# EAGLE design ADC Board(Two Board,Molex) (EAGLE 7.6.0)
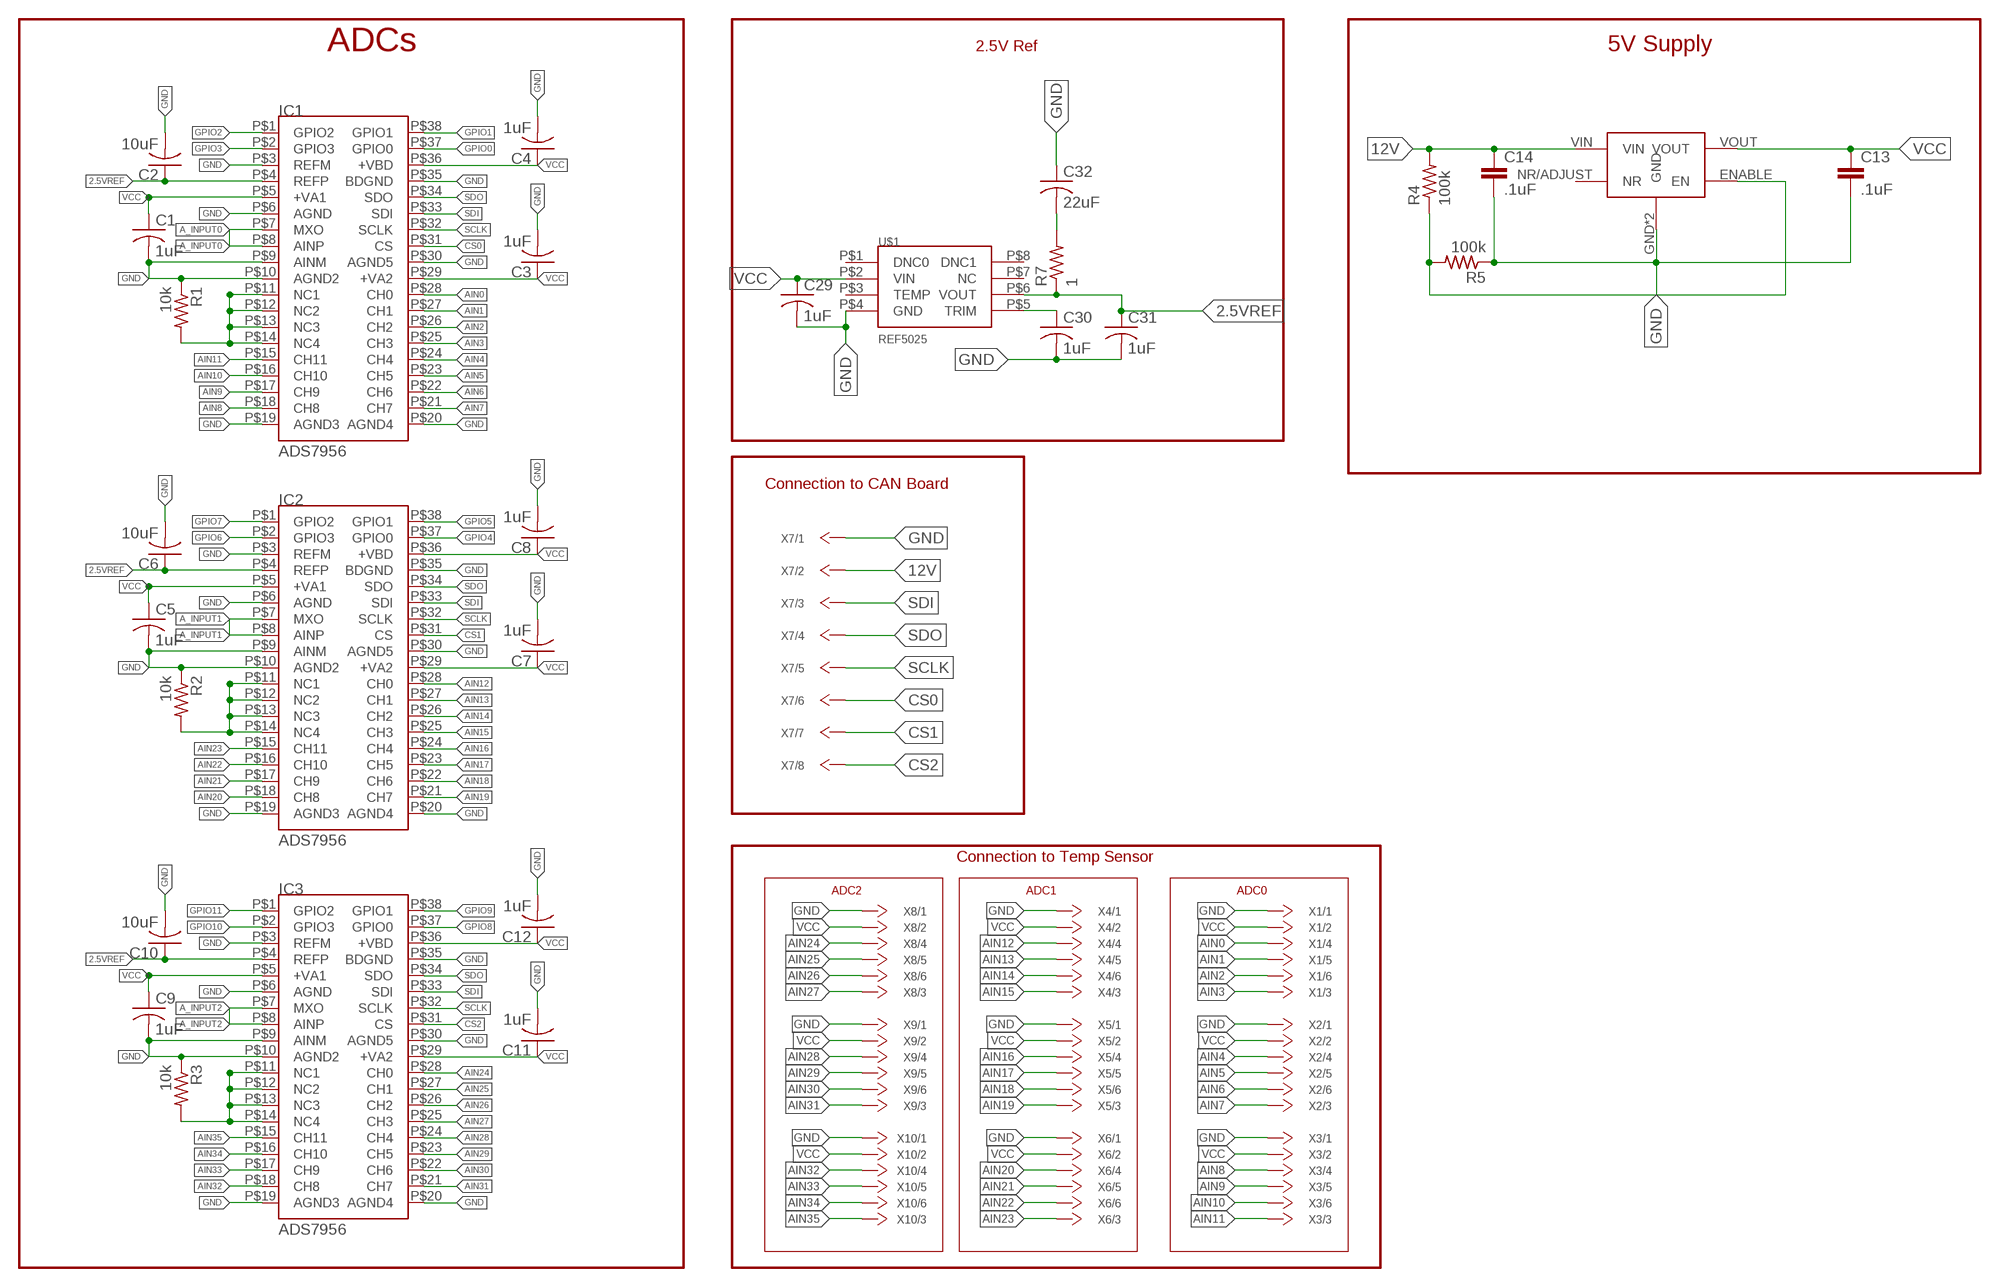
[diagram p0: schematic, sheet 1]

## Parts
C1  1uF  C-USC0603  [C0603]
C2  10uF  C-USC0603  [C0603]
C3  1uF  C-USC0603  [C0603]
C4  1uF  C-USC0603  [C0603]
C5  1uF  C-USC0603  [C0603]
C6  10uF  C-USC0603  [C0603]
C7  1uF  C-USC0603  [C0603]
C8  1uF  C-USC0603  [C0603]
C9  1uF  C-USC0603  [C0603]
C10  10uF  C-USC0603  [C0603]
C11  1uF  C-USC0603  [C0603]
C12  1uF  C-USC0603  [C0603]
C13  .1uF  C-EUC0603  [C0603]
C14  .1uF  C-EUC0603  [C0603]
C29  1uF  C-USC0603  [C0603]
C30  1uF  C-USC0603  [C0603]
C31  1uF  C-USC0603  [C0603]
C32  22uF  C-USC0603  [C0603]
IC1  ADS7956  [TSSOP-38]
IC2  ADS7956  [TSSOP-38]
IC3  ADS7956  [TSSOP-38]
R1  10k  R-US_R0603  [R0603]
R2  10k  R-US_R0603  [R0603]
R3  10k  R-US_R0603  [R0603]
R4  100k  R-US_M0805  [M0805]
R5  100k  R-US_M0805  [M0805]
R7  1  R-US_M0805  [M0805]
U$1  REF5025  [TSSOP-8(TI)]
U$2  REG-104GA-5  [REG104GA-5]
X1  6_PIN_CONNMOLEX_HORI  [6_PIN_MOLEX]
X2  6_PIN_CONNMOLEX_HORI  [6_PIN_MOLEX]
X3  6_PIN_CONNMOLEX_HORI  [6_PIN_MOLEX]
X4  6_PIN_CONNMOLEX_HORI  [6_PIN_MOLEX]
X5  6_PIN_CONNMOLEX_HORI  [6_PIN_MOLEX]
X6  6_PIN_CONNMOLEX_HORI  [6_PIN_MOLEX]
X7  8_PIN_CONN  [8_PIN_MOLEX]
X8  6_PIN_CONNMOLEX_HORI  [6_PIN_MOLEX]
X9  6_PIN_CONNMOLEX_HORI  [6_PIN_MOLEX]
X10  6_PIN_CONNMOLEX_HORI  [6_PIN_MOLEX]

## Nets
2.5VREF: C2.1 C6.1 C10.1 C31.1 IC1.P$4(REFP) IC2.P$4(REFP) IC3.P$4(REFP) R7.1 U$1.P$6(VOUT)
12V: C14.1 R4.2 U$2.VIN X7.P$2
A_INPUT0: IC1.P$7(MXO) IC1.P$8(AINP)
A_INPUT1: IC2.P$7(MXO) IC2.P$8(AINP)
A_INPUT2: IC3.P$7(MXO) IC3.P$8(AINP)
AIN0: IC1.P$28(CH0) X1.P$4
AIN1: IC1.P$27(CH1) X1.P$5
AIN2: IC1.P$26(CH2) X1.P$6
AIN3: IC1.P$25(CH3) X1.P$3
AIN4: IC1.P$24(CH4) X2.P$4
AIN5: IC1.P$23(CH5) X2.P$5
AIN6: IC1.P$22(CH6) X2.P$6
AIN7: IC1.P$21(CH7) X2.P$3
AIN8: IC1.P$18(CH8) X3.P$4
AIN9: IC1.P$17(CH9) X3.P$5
AIN10: IC1.P$16(CH10) X3.P$6
AIN11: IC1.P$15(CH11) X3.P$3
AIN12: IC2.P$28(CH0) X4.P$4
AIN13: IC2.P$27(CH1) X4.P$5
AIN14: IC2.P$26(CH2) X4.P$6
AIN15: IC2.P$25(CH3) X4.P$3
AIN16: IC2.P$24(CH4) X5.P$4
AIN17: IC2.P$23(CH5) X5.P$5
AIN18: IC2.P$22(CH6) X5.P$6
AIN19: IC2.P$21(CH7) X5.P$3
AIN20: IC2.P$18(CH8) X6.P$4
AIN21: IC2.P$17(CH9) X6.P$5
AIN22: IC2.P$16(CH10) X6.P$6
AIN23: IC2.P$15(CH11) X6.P$3
AIN24: IC3.P$28(CH0) X8.P$4
AIN25: IC3.P$27(CH1) X8.P$5
AIN26: IC3.P$26(CH2) X8.P$6
AIN27: IC3.P$25(CH3) X8.P$3
AIN28: IC3.P$24(CH4) X9.P$4
AIN29: IC3.P$23(CH5) X9.P$5
AIN30: IC3.P$22(CH6) X9.P$6
AIN31: IC3.P$21(CH7) X9.P$3
AIN32: IC3.P$18(CH8) X10.P$4
AIN33: IC3.P$17(CH9) X10.P$5
AIN34: IC3.P$16(CH10) X10.P$6
AIN35: IC3.P$15(CH11) X10.P$3
CS0: IC1.P$31(CS) X7.P$6
CS1: IC2.P$31(CS) X7.P$7
CS2: IC3.P$31(CS) X7.P$8
ENABLE: R4.1 R5.2 U$2.ENABLE(EN)
GND: C1.2 C2.2 C3.2 C4.2 C5.2 C6.2 C7.2 C8.2 C9.2 C10.2 C11.2 C12.2 C13.2 C14.2 C29.2 C30.2 C31.2 C32.1 IC1.P$3(REFM) IC1.P$6(AGND) IC1.P$9(AINM) IC1.P$10(AGND2) IC1.P$19(AGND3) IC1.P$20(AGND4) IC1.P$30(AGND5) IC1.P$35(BDGND) IC2.P$3(REFM) IC2.P$6(AGND) IC2.P$9(AINM) IC2.P$10(AGND2) IC2.P$19(AGND3) IC2.P$20(AGND4) IC2.P$30(AGND5) IC2.P$35(BDGND) IC3.P$3(REFM) IC3.P$6(AGND) IC3.P$9(AINM) IC3.P$10(AGND2) IC3.P$19(AGND3) IC3.P$20(AGND4) IC3.P$30(AGND5) IC3.P$35(BDGND) R1.1 R2.1 R3.1 R5.1 U$1.P$4(GND) U$2.GND U$2.HEATGND(GND) X1.P$1 X2.P$1 X3.P$1 X4.P$1 X5.P$1 X6.P$1 X7.P$1 X8.P$1 X9.P$1 X10.P$1
GPIO0: IC1.P$37(GPIO0)
GPIO1: IC1.P$38(GPIO1)
GPIO2: IC1.P$1(GPIO2)
GPIO3: IC1.P$2(GPIO3)
GPIO4: IC2.P$37(GPIO0)
GPIO5: IC2.P$38(GPIO1)
GPIO6: IC2.P$2(GPIO3)
GPIO7: IC2.P$1(GPIO2)
GPIO8: IC3.P$37(GPIO0)
GPIO9: IC3.P$38(GPIO1)
GPIO10: IC3.P$2(GPIO3)
GPIO11: IC3.P$1(GPIO2)
N$3: C32.2 R7.2
NC: IC1.P$11(NC1) IC1.P$12(NC2) IC1.P$13(NC3) IC1.P$14(NC4) R1.2
NC1: IC2.P$11(NC1) IC2.P$12(NC2) IC2.P$13(NC3) IC2.P$14(NC4) R2.2
NC2: IC3.P$11(NC1) IC3.P$12(NC2) IC3.P$13(NC3) IC3.P$14(NC4) R3.2
SCLK: IC1.P$32(SCLK) IC2.P$32(SCLK) IC3.P$32(SCLK) X7.P$5
SDI: IC1.P$33(SDI) IC2.P$33(SDI) IC3.P$33(SDI) X7.P$3
SDO: IC1.P$34(SDO) IC2.P$34(SDO) IC3.P$34(SDO) X7.P$4
TRIM: C30.1 U$1.P$5(TRIM)
VCC: C1.1 C3.1 C4.1 C5.1 C7.1 C8.1 C9.1 C11.1 C12.1 C13.1 C29.1 IC1.P$5(+VA1) IC1.P$29(+VA2) IC1.P$36(+VBD) IC2.P$5(+VA1) IC2.P$29(+VA2) IC2.P$36(+VBD) IC3.P$5(+VA1) IC3.P$29(+VA2) IC3.P$36(+VBD) U$1.P$2(VIN) U$2.VOUT X1.P$2 X2.P$2 X3.P$2 X4.P$2 X5.P$2 X6.P$2 X8.P$2 X9.P$2 X10.P$2
Unconnected: U$1.P$1(DNC0) U$1.P$3(TEMP) U$1.P$7(NC) U$1.P$8(DNC1) U$2.NR/ADJUST(NR)

## Notes on the sheet
- ADCs | 2.5V Ref | 5V Supply
- Connection to CAN Board
- Connection to Temp Sensor
- ADC2 | ADC1 | ADC0

## Library data of the parts
C1-C12 C29-C32 = adafruit:C-US: CAPACITOR, American symbol
C13 C14 = rcl:C-EU: CAPACITOR, European symbol
IC1-IC3 = BMS Lbr:ADS7956
R1-R3 = resistor:R-US_: RESISTOR, American symbol
R4 R5 = rcl:R-US_: RESISTOR, American symbol
R7 = adafruit:R-US_: RESISTOR, American symbol
U$1 = BMS Lbr:REF5025: 2.5V Voltage Reference
U$2 = DashAndCAN library:REG-104GA-5
X1-X6 X8-X10 = BMS Lbr:6_PIN_CONN: 6 Pin Connector
X7 = BMS Lbr:8_PIN_CONN

## Board
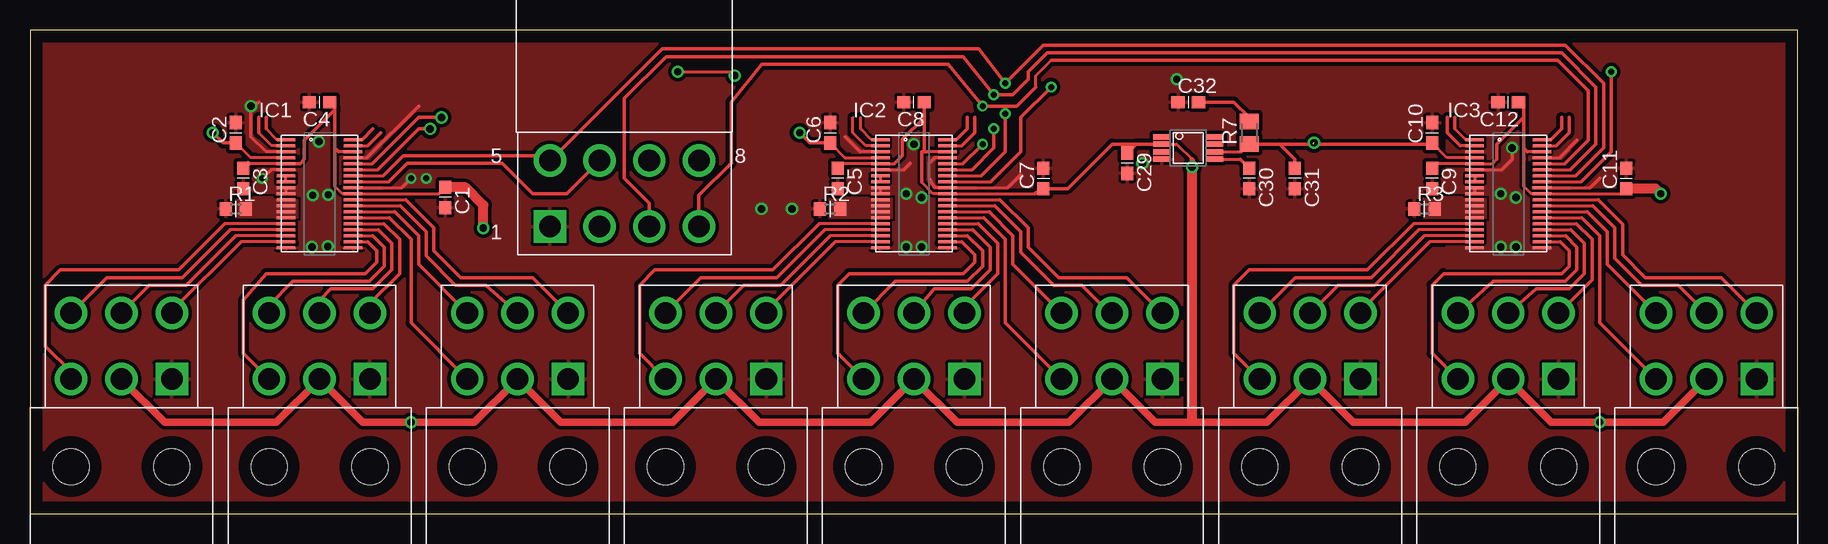
[diagram p1: board, top side]
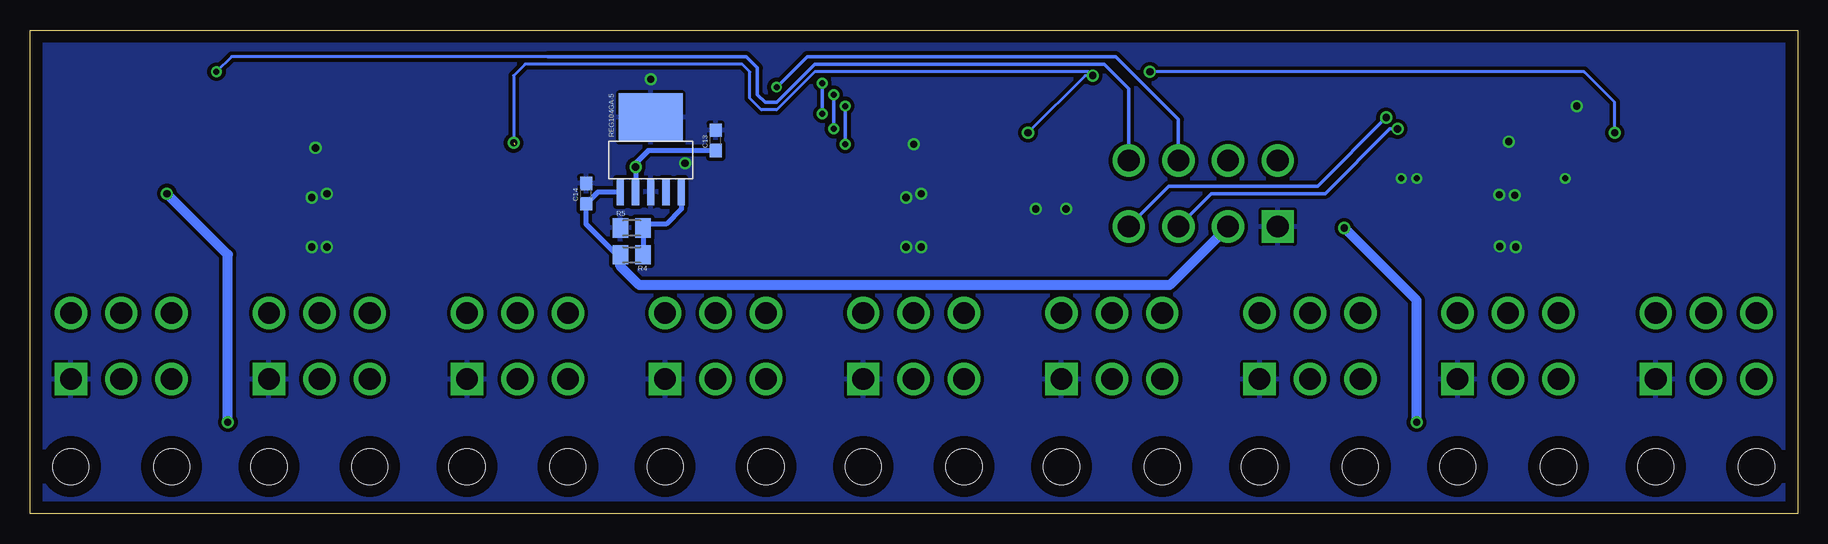
[diagram p2: board, bottom side, seen from below]

Size 147.3 x 40.31 mm. Coordinates in mm from the lower left corner, seen from the top.
Outline: 0,0 147.3,0 147.3,40.31 0,40.31 0,0
Copper layers (1*16): Top 0.035mm / dielectric 1.5mm / Bottom 0.035mm
Design rules "default": minimum track width 10mil, minimum drill 24mil, track to track 8mil, track to pad 8mil, pad to pad 8mil, via to via 8mil, smd to smd 8mil, copper to edge 40mil, drill to drill 8mil, minimum pad ring 10mil, minimum via ring 8mil, stop-mask expansion 4mil, vias tented up to drill 0mil, thermal gap 10mil

### Footprints (pad centres in the part's own frame; a part is rotated, then mirrored left to right if it is on the bottom)
C0603 = smd 1.1 x 1: 1 -0.85,0; 2 0.85,0
TSSOP-38 = smd 1.55 x 0.25: P$1 -2.8,4.5; P$2 -2.8,4; P$3 -2.8,3.5; P$4 -2.8,3; P$5 -2.8,2.5; P$6 -2.8,2; P$7 -2.8,1.5; P$8 -2.8,1; P$9 -2.8,0.5; P$10 -2.8,0; P$11 -2.8,-0.5; P$12 -2.8,-1; P$13 -2.8,-1.5; P$14 -2.8,-2; P$15 -2.8,-2.5; P$16 -2.8,-3; P$17 -2.8,-3.5; P$18 -2.8,-4; P$19 -2.8,-4.5; P$20 2.8,-4.5; P$21 2.8,-4; P$22 2.8,-3.5; P$23 2.8,-3; P$24 2.8,-2.5; P$25 2.8,-2; P$26 2.8,-1.5; P$27 2.8,-1; P$28 2.8,-0.5; P$29 2.8,0; P$30 2.8,0.5; P$31 2.8,1; P$32 2.8,1.5; P$33 2.8,2; P$34 2.8,2.5; P$35 2.8,3; P$36 2.8,3.5; P$37 2.8,4; P$38 2.8,4.5
R0603 = smd 1 x 1.1: 1 -0.85,0; 2 0.85,0
M0805 = smd 1.3 x 1.6: 1 -0.95,0; 2 0.95,0
TSSOP-8(TI) = smd 0.45 x 1.45: P$1 -0.925,-2.2; P$2 -0.325,-2.2; P$3 0.325,-2.2; P$4 0.925,-2.2; P$5 0.925,2.2; P$6 0.325,2.2; P$7 -0.325,2.2; P$8 -0.925,2.2
REG104GA-5 = smd 0.6 x 2.2: ENABLE 2.54,-6.2; GND 0,-6.2; NR/ADJUST 1.27,-6.2; VIN -2.54,-6.2; VOUT -1.27,-6.2 | smd 5.3 x 4: HEATGND 0,0
6_PIN_MOLEX = drill 1.8 square: P$1 4.2,-2.75 | drill 1.8: P$2 0,-2.75; P$3 -4.2,-2.75; P$4 4.2,2.75; P$5 0,2.75; P$6 -4.2,2.75 | hole 3: 4.2,-10.05; -4.2,-10.05
8_PIN_MOLEX = drill 1.8 square: P$1 6.21,2.75 | drill 1.8: P$2 2.07,2.75; P$3 -2.07,2.75; P$4 -6.21,2.75; P$5 6.21,-2.75; P$6 2.07,-2.75; P$7 -2.07,-2.75; P$8 -6.21,-2.75

### Placement (x,y rotation side)
C1  34.61,26.35 270 top
C2  17.14,31.75 90 top
C3  17.78,27.94 270 top
C4  24.13,34.29 180 top
C5  67.31,27.94 270 top
C6  66.67,31.75 90 top
C7  84.45,27.94 90 top
C8  73.66,34.29 180 top
C9  116.84,27.94 270 top
C10  116.84,31.75 90 top
C11  133.03,27.94 90 top
C12  123.19,34.29 180 top
C13  90.17,31.11 90 bottom
C14  100.97,26.67 90 bottom
C29  91.44,29.21 270 top
C30  101.6,27.94 270 top
C31  105.41,27.94 270 top
C32  96.52,34.29 0 top
IC1  24.13,26.67 0 top
IC2  73.66,26.67 0 top
IC3  123.19,26.67 0 top
R1  17.14,25.4 0 top
R2  66.67,25.4 0 top
R3  116.2,25.4 0 top
R4  97.16,21.59 180 bottom
R5  97.16,23.81 0 bottom
R7  101.6,31.75 90 top
U$1  96.52,30.48 270 top
U$2  95.57,33.02 0 bottom
X1  40.64,13.97 0 top
X2  24.13,13.97 0 top
X3  7.62,13.97 0 top
X4  90.17,13.97 0 top
X5  73.66,13.97 0 top
X6  57.15,13.97 0 top
X7  49.53,26.67 180 top
X8  139.7,13.97 0 top
X9  123.19,13.97 0 top
X10  106.68,13.97 0 top

### Tracks (layer width: path | path; a pad name or v marks a point on that pad's centre or on a via)
2.5VREF  (via drill 0.6)  (1 unrouted)
  Top 0.254: IC1.P$4 18.38,29.67 C2.1 | C6.1 67.91,29.67 IC2.P$4 | IC3.P$4 118.07,29.67 C10.1 116.84,30.8 | U$1.P$6 100.95,30.16 | 106.89,30.8 105.41,30.8 | v53.98,36.83 58.42,36.83 v58.74,36.51
  Top 0.305: 100.95,30.16 R7.1 104.14,30.8 | 104.14,30.8 105.41,30.8 116.84,30.8 | C2.1 16.09,30.9 v15.24,31.75 | C6.1 64.98,30.9 v64.14,31.75 | C31.1 105.41,29.53 104.14,30.8 | C10.1
  Bottom 0.254: v15.24,31.75 15.24,34.29 17.78,36.83 v53.98,36.83 | v64.14,31.75 59.37,36.51 v58.74,36.51 59.05,36.83 81.92,36.83 85.09,33.66 86.36,33.66 87.31,34.61 87.31,36.83 87.95,37.47 106.05,37.47 107,36.51 v107,30.91
12V
  Bottom 0.406: R4.2 98.42,21.59 100.97,24.13 C14.1 99.97,26.82 U$2.VIN
  Bottom 0.813: X7.P$2 52.33,19.05 96.52,19.05 98.11,20.64 R4.2
A_INPUT0
  Top 0.254: IC1.P$8 IC1.P$7
A_INPUT1
  Top 0.254: IC2.P$7 IC2.P$8
A_INPUT2
  Top 0.254: IC3.P$7 IC3.P$8
AIN0
  Top 0.254: IC1.P$28 31.3,26.17
  Top 0.305: 31.3,26.17 33.66,23.81 33.66,21.91 35.88,19.68 41.88,19.68 X1.P$4
AIN1
  Top 0.254: IC1.P$27 30.84,25.67
  Top 0.305: 30.84,25.67 33.02,23.5 33.02,21.48 35.45,19.05 37.99,19.05 X1.P$5
AIN2
  Top 0.254: IC1.P$26 30.39,25.17
  Top 0.305: 30.39,25.17 32.38,23.18 32.38,20.77 X1.P$6
AIN3
  Top 0.254: IC1.P$25 29.94,24.67
  Top 0.305: 29.94,24.67 31.75,22.86 31.75,15.91 X1.P$3
AIN4
  Top 0.254: IC1.P$24 29.49,24.17
  Top 0.305: 29.49,24.17 30.8,22.86 30.8,20 28.33,17.54 X2.P$4
AIN5
  Top 0.254: IC1.P$23 29.04,23.67
  Top 0.305: 29.04,23.67 30.16,22.54 30.16,20.32 28.57,18.73 25.08,18.73 24.13,17.78 X2.P$5
AIN6
  Top 0.254: IC1.P$22 28.58,23.17
  Top 0.305: 28.58,23.17 29.53,22.23 29.53,20.64 28.26,19.37 21.91,19.37 19.93,17.39 X2.P$6
AIN7
  Top 0.254: IC1.P$21 28.13,22.67
  Top 0.305: 28.13,22.67 28.89,21.91 28.89,20.95 27.94,20 19.68,20 17.78,17.78 17.78,13.37 X2.P$3
AIN8
  Top 0.254: IC1.P$18 17.59,22.67
  Top 0.305: 17.59,22.67 11.82,16.9 X3.P$4
AIN9
  Top 0.254: IC1.P$17 17.14,23.17
  Top 0.305: 17.14,23.17 13.02,19.05 9.95,19.05 X3.P$5
AIN10
  Top 0.254: IC1.P$16 16.68,23.67
  Top 0.305: 16.68,23.67 12.7,19.68 6.38,19.68 X3.P$6
AIN11
  Top 0.254: IC1.P$15 16.23,24.17
  Top 0.305: 16.23,24.17 12.38,20.32 2.54,20.32 1.27,19.05 1.27,13.97 3.42,11.82 X3.P$3
AIN12
  Top 0.254: IC2.P$28 80.83,26.17
  Top 0.305: 80.83,26.17 83.19,23.81 83.19,22.23 85.72,19.68 91.41,19.68 X4.P$4
AIN13
  Top 0.254: IC2.P$27 80.38,25.67
  Top 0.305: 80.38,25.67 82.55,23.5 82.55,21.8 85.3,19.05 87.63,19.05 89.96,16.72 X4.P$5
AIN14
  Top 0.254: IC2.P$26 79.92,25.17
  Top 0.305: 79.92,25.17 81.92,23.18 81.92,20.77 X4.P$6
AIN15
  Top 0.254: IC2.P$25 79.47,24.67
  Top 0.305: 79.47,24.67 81.28,22.86 81.28,15.91 X4.P$3
AIN16
  Top 0.254: IC2.P$24 79.02,24.17
  Top 0.305: 79.02,24.17 80.64,22.54 80.64,20 77.86,17.22 X5.P$4
AIN17
  Top 0.254: IC2.P$23 78.56,23.67
  Top 0.305: 78.56,23.67 80.01,22.23 80.01,20.32 78.42,18.73 75.36,18.73 X5.P$5
AIN18
  Top 0.254: IC2.P$22 78.11,23.17
  Top 0.305: 78.11,23.17 79.38,21.91 79.38,20.64 78.11,19.37 72.11,19.37 X5.P$6
AIN19
  Top 0.254: IC2.P$21 77.66,22.67
  Top 0.305: 77.66,22.67 78.74,21.59 78.74,20.95 77.79,20 68.26,20 67.31,19.05 67.31,13.37 X5.P$3
AIN20
  Top 0.254: IC2.P$18 67.12,22.67
  Top 0.305: 67.12,22.67 61.35,16.9 X6.P$4
AIN21
  Top 0.254: IC2.P$17 66.67,23.17
  Top 0.305: 66.67,23.17 62.55,19.05 59.48,19.05 X6.P$5
AIN22
  Top 0.254: IC2.P$16 66.22,23.67
  Top 0.305: 66.22,23.67 62.23,19.68 55.91,19.68 X6.P$6
AIN23
  Top 0.254: IC2.P$15 65.76,24.17
  Top 0.305: 65.76,24.17 61.91,20.32 52.07,20.32 50.8,19.05 50.8,13.37 X6.P$3
AIN24
  Top 0.254: IC3.P$28 130.68,26.17
  Top 0.305: 130.68,26.17 132.72,24.13 132.72,21.59 134.62,19.68 140.94,19.68 X8.P$4
AIN25
  Top 0.254: IC3.P$27 130.22,25.67
  Top 0.305: 130.22,25.67 132.08,23.81 132.08,21.27 134.3,19.05 137.37,19.05 X8.P$5
AIN26
  Top 0.254: IC3.P$26 129.77,25.17
  Top 0.305: 129.77,25.17 131.44,23.5 131.44,20.77 X8.P$6
AIN27
  Top 0.254: IC3.P$25 129.32,24.67
  Top 0.305: 129.32,24.67 130.81,23.18 130.81,15.91 X8.P$3
AIN28
  Top 0.254: IC3.P$24 128.87,24.17
  Top 0.305: 128.87,24.17 130.18,22.86 130.18,19.5 X9.P$4
AIN29
  Top 0.254: IC3.P$23 128.41,23.67
  Top 0.305: 128.41,23.67 129.54,22.54 129.54,20 128.27,18.73 125.52,18.73 X9.P$5
AIN30
  Top 0.254: IC3.P$22 127.96,23.17
  Top 0.305: 127.96,23.17 128.91,22.23 128.91,20.32 127.95,19.37 121.95,19.37 X9.P$6
AIN31
  Top 0.254: IC3.P$21 127.51,22.67
  Top 0.305: 127.51,22.67 128.27,21.91 128.27,20.64 127.64,20 117.79,20 116.84,19.05 116.84,13.37 X9.P$3
AIN32
  Top 0.254: IC3.P$18 116.65,22.67
  Top 0.305: 116.65,22.67 110.88,16.9 X10.P$4
AIN33
  Top 0.254: IC3.P$17 116.2,23.17
  Top 0.305: 116.2,23.17 112.08,19.05 109.01,19.05 X10.P$5
AIN34
  Top 0.254: IC3.P$16 115.75,23.67
  Top 0.305: 115.75,23.67 111.76,19.68 105.44,19.68 X10.P$6
AIN35
  Top 0.254: IC3.P$15 115.29,24.17
  Top 0.305: 115.29,24.17 111.44,20.32 101.6,20.32 100.33,19.05 100.33,13.37 X10.P$3
CS0
  Top 0.254: IC1.P$31 29.89,27.67
  Top 0.305: 29.89,27.67 31.43,29.21 39.37,29.21 41.91,26.67 44.71,26.67 X7.P$6
CS1  (via drill 0.5)
  Top 0.254: IC2.P$31 80.06,27.67
  Top 0.305: 80.06,27.67 82.55,30.16 82.55,33.02 v85.09,35.56
  Bottom 0.305: X7.P$7 51.6,32.87 56.83,38.1 82.55,38.1 v85.09,35.56
CS2  (via drill 0.5)
  Top 0.254: IC3.P$31 129.27,27.67
  Top 0.305: 129.27,27.67 131.76,30.16 v131.76,36.83
  Bottom 0.254: 104.14,38.1 130.49,38.1 v131.76,36.83
  Bottom 0.305: X7.P$8 55.74,35.42 57.78,37.47 81.92,37.47 85.09,34.29 86.04,34.29 86.68,34.92 86.68,37.15 87.63,38.1 104.14,38.1
ENABLE
  Bottom 0.406: U$2.ENABLE 93.03,25.4 94.3,24.13 95.57,24.13 R5.2 R4.1
GND  (via drill 0.5, 0.6)
  Top 0.254: IC2.P$9 IC2.P$10 | IC1.P$9 IC1.P$10 | IC3.P$30 130.04,27.17 | IC1.P$3 19.68,30.17 18.41,31.43 | IC2.P$3 69.21,30.17 | 81.46,27.17 IC2.P$30 75.38,27.17 74.93,27.94 74.93,29.21 | IC2.P$35 75.39,29.67 | IC1.P$30 30.98,27.17 | IC1.P$35 28.08,29.67 | IC1.P$6 20.1,28.67 | IC3.P$6 122.65,28.67 | IC3.P$35 127.46,29.67 | IC2.P$6 72.8,28.67
  Top 0.305: IC3.P$9 IC3.P$10 | 130.04,27.17 130.81,27.94 | 18.41,31.43 v18.41,33.97 19.05,34.29 | 69.21,30.17 67.94,31.43 | 81.46,27.17 82.55,28.26 82.55,27.94 | 74.93,29.21 75.39,29.67 | 30.98,27.17 v31.75,27.94 | 28.08,29.67 32.38,33.97 | 20.1,28.67 v19.37,27.94 | 122.65,28.67 123.51,29.53 v123.51,30.48 | 127.46,29.67 128.91,31.11 | 72.8,28.67 73.34,29.21
  other vias: 23.5,22.23 24.82,22.28 23.57,26.54 24.87,26.57 24.08,31.01 73.03,22.23 74.3,22.23 73.03,26.67 74.3,26.35 73.66,30.8 122.56,22.23 123.83,22.23 123.83,26.35 122.56,26.67 33.02,27.94 63.5,25.4 60.96,25.4 92.71,29.21 95.57,36.2
  pour Top (rank 6, no thermals): 19.05,22.86 29.21,22.86 29.21,33.02 19.05,33.02
  pour Bottom (isolate 0.305, rank 6): 0,0 147.32,0 147.32,40.64 0,40.64
  pour Top (isolate 0.305, rank 5): 0,0 147.32,0 147.32,40.64 0,40.64
  pour Top (rank 6, no thermals): 68.58,22.86 78.74,22.86 78.74,33.02 68.58,33.02
  pour Top (rank 6, no thermals): 118.11,20.32 128.27,20.32 128.27,33.02 118.11,33.02
GPIO0
  Top 0.254: IC1.P$37 28.13,30.67
  Top 0.305: 28.13,30.67 29.21,31.75
GPIO1
  Top 0.254: IC1.P$38 27.68,31.17
  Top 0.305: 27.68,31.17 28.57,32.07
GPIO2
  Top 0.254: IC1.P$1 20.58,31.17 19.68,32.07
  Top 0.305: 19.68,32.07 19.68,33.02
GPIO3
  Top 0.254: IC1.P$2 20.13,30.67 19.05,31.75
  Top 0.305: 19.05,31.75 19.05,33.02
GPIO4
  Top 0.254: IC2.P$37 77.66,30.67
  Top 0.305: 77.66,30.67 78.74,31.75 78.74,33.02
GPIO5
  Top 0.254: IC2.P$38 77.21,31.17
  Top 0.305: 77.21,31.17 78.11,32.07 78.11,33.02
GPIO6
  Top 0.254: IC2.P$2 69.66,30.67 68.58,31.75 68.58,33.02
GPIO7
  Top 0.254: IC2.P$1 70.11,31.17 69.22,32.07 69.22,33.02
GPIO8
  Top 0.254: IC3.P$37 127.19,30.67
  Top 0.305: 127.19,30.67 128.27,31.75 128.27,33.02
GPIO9
  Top 0.254: IC3.P$38 126.74,31.17
  Top 0.305: 126.74,31.17 127.64,32.07 127.64,33.02
GPIO10
  Top 0.254: IC3.P$2 119.19,30.67
  Top 0.305: 119.19,30.67 118.11,31.75 118.11,33.02
GPIO11
  Top 0.254: IC3.P$1 119.64,31.17 118.75,32.07
  Top 0.305: 118.75,32.07 118.75,33.02
N$3
  Top 0.305: R7.2 101.6,33.02 100.33,34.29 C32.2
NC
  pour Top (isolate 0.305, no thermals): 16.89,24.59 22.23,24.59 22.23,26.34 16.94,26.34
NC1
  pour Top (isolate 0.254, no thermals): 71.75,24.59 66.67,24.59 66.67,26.34 71.75,26.34
NC2
  pour Top (isolate 0.254, no thermals): 116.2,26.34 121.28,26.34 121.28,24.59 116.2,24.59
SCLK  (via drill 0.5)
  Top 0.254: IC3.P$32 128.82,28.17 | IC2.P$32 79.29,28.17 | IC1.P$32 29.44,28.17
  Top 0.305: 128.82,28.17 131.13,30.48 131.13,35.88 127.95,39.05 84.45,39.05 v81.28,35.88 79.06,38.73 52.7,38.73 43.95,29.98 X7.P$5 42.9,29.84 31.11,29.84 29.44,28.17 | 79.29,28.17 81.28,30.16 v81.28,33.34
  Bottom 0.305: v81.28,35.88 v81.28,33.34
SDI  (via drill 0.5, 0.6)
  Top 0.254: IC3.P$33 128.37,28.67 | IC2.P$33 78.52,28.67 | IC1.P$33 28.99,28.67
  Top 0.305: 128.37,28.67 130.49,30.8 130.49,35.56 127.64,38.42 84.77,38.42 83.19,36.83 83.19,36.2 81.92,34.92 v80.33,34.92 77.79,38.1 53.02,38.1 49.53,34.61 49.53,27.94 51.6,25.87 X7.P$3 | 78.52,28.67 80.33,30.48 v80.33,32.07 | 28.99,28.67 32.38,32.07 v33.34,32.07
  Bottom 0.305: v33.34,32.07 33.97,32.07 39.37,26.67 48.85,26.67 X7.P$3 | v80.33,34.92 v80.33,32.07
SDO  (via drill 0.5, 0.6)
  Top 0.254: IC3.P$34 127.91,29.17 | IC2.P$34 77.75,29.17 | IC1.P$34 28.54,29.17 | 83.82,35.56 83.82,36.51 85.09,37.78
  Top 0.305: 127.91,29.17 129.86,31.11 129.86,35.24 127.32,37.78 85.09,37.78 | 77.75,29.17 v79.38,30.8 | 28.54,29.17 32.38,33.02 v34.29,33.02 | X7.P$4 55.74,26.53 58.42,29.21 58.42,34.29 60.96,37.47 76.52,37.47 v79.38,33.97 82.23,33.97 83.82,35.56
  Bottom 0.305: v34.29,33.02 40.01,27.3 52.39,27.3 55.1,24.59 X7.P$4 | v79.38,33.97 v79.38,30.8
TRIM
  Top 0.254: U$1.P$5 100.83,29.55
  Top 0.305: 100.83,29.55 C30.1
VCC  (via drill 0.6)
  Top 0.254: IC2.P$36 74.92,30.17 | IC3.P$36 124.77,30.17 | IC1.P$36 25.71,30.17 | IC1.P$5 18.16,29.17 | 67.69,29.17 IC2.P$5 72.03,29.17 | 83.72,26.67 IC2.P$29 75.25,26.67 74.3,27.62 | 132.61,26.67 IC3.P$29 125.09,26.67 124.46,27.3 | 117.22,29.17 IC3.P$5 121.88,29.17 122.24,29.53 | 34.08,26.67 IC1.P$29 26.04,26.67 25.4,27.3 | U$1.P$2 95.56,30.8 96.84,29.53
  Top 0.305: C29.1 92.19,30.8 U$1.P$2 90.17,30.8 86.46,27.09 C7.1 83.72,26.67 | 74.52,33.01 74.52,30.17 74.92,30.17 74.3,30.16 74.3,27.62 | 74.52,33.01 C8.1 | 124.77,30.17 124.46,30.48 | 124.46,30.48 124.46,33.02 | 124.46,33.02 124.46,33.87 C12.1 | 25.71,30.17 25.4,30.48 | 25.4,30.48 25.4,33.66 | 25.4,33.66 25.4,33.87 C4.1 | 67.69,29.17 C5.1 | 132.61,26.67 C11.1 | 117.22,29.17 C9.1 | 34.08,26.67 C1.1 | 25.4,27.3 25.4,30.48 | IC1.P$5 22.5,29.17 22.86,29.53 22.86,31.11 25.4,33.66 | 72.03,29.17 72.71,29.84 72.71,31.19 74.52,33.01 | 122.24,29.53 122.24,30.8 124.46,33.02 | 124.46,27.3 124.46,30.48
  Top 0.406: 18.16,29.17 C3.1 | 96.84,29.53 v96.84,28.89 | 96.84,7.94 97.16,7.62
  Top 0.61: X3.P$2 11.22,7.62 20.53,7.62 X2.P$2 27.73,7.62 v31.75,7.62 37.04,7.62 X1.P$2 44.24,7.62 53.55,7.62 X6.P$2 60.75,7.62 70.06,7.62 X5.P$2 77.26,7.62 86.57,7.62 X4.P$2 93.77,7.62 97.16,7.62 103.08,7.62 X10.P$2 110.28,7.62 119.59,7.62 X9.P$2 126.79,7.62 v130.81,7.62 136.1,7.62 X8.P$2
  Top 0.813: 96.84,7.94 v96.84,28.89 | v135.89,26.67 135.47,27.09 C11.1 | v37.78,23.81 37.78,25.72 36.3,27.2 C1.1
  Bottom 0.406: C13.1 95.78,30.27 96.84,29.21 v96.84,28.89 U$2.VOUT
  Bottom 0.813: v130.81,7.62 130.81,21.59 v135.89,26.67 | v31.75,7.62 31.75,17.78 v37.78,23.81